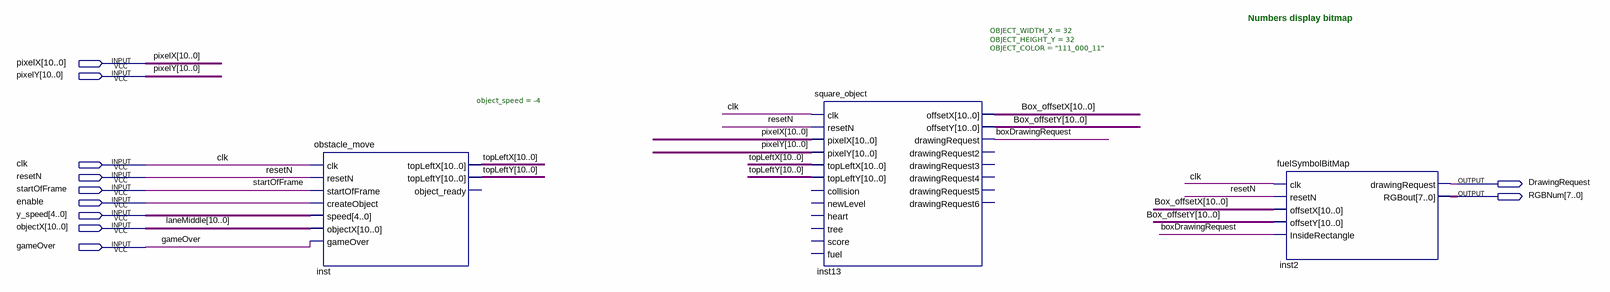
[diagram p0: schematic sheet]
// Quartus schematic fuel_symbol_block.bdf as structural Verilog: 3 symbols, 11 pins
module fuel_symbol_block (
  input  [10:0] pixelX,
  input  [10:0] pixelY,
  input  clk,
  input  resetN,
  input  startOfFrame,
  input  enable,
  input  [4:0] y_speed,
  input  [10:0] objectX,
  input  gameOver,
  output DrawingRequest,
  output [7:0] RGBNum
);

  wire boxDrawingRequest;
  wire [10:0] Box_offsetX, Box_offsetY, topLeftX, topLeftY;

  obstacle_move #(.object_speed(-4)) inst (
    .clk(clk), .resetN(resetN), .startOfFrame(startOfFrame), .createObject(enable), .speed(y_speed),
    .objectX(objectX), .gameOver(gameOver), .topLeftX(topLeftX), .topLeftY(topLeftY));  // open: object_ready
  square_object #(.OBJECT_WIDTH_X(32), .OBJECT_HEIGHT_Y(32), .OBJECT_COLOR("111_000_11")) inst13 (
    .clk(clk), .resetN(resetN), .pixelX(pixelX), .pixelY(pixelY), .topLeftX(topLeftX), .topLeftY(topLeftY),
    .offsetX(Box_offsetX), .offsetY(Box_offsetY), .drawingRequest(boxDrawingRequest));  // open: collision, newLevel, heart, tree, score, fuel, drawingRequest2, drawingRequest3, drawingRequest4, drawingRequest5, drawingRequest6
  fuelSymbolBitMap inst2 (
    .clk(clk), .resetN(resetN), .offsetX(Box_offsetX), .offsetY(Box_offsetY),
    .InsideRectangle(boxDrawingRequest), .drawingRequest(DrawingRequest), .RGBout(RGBNum));

  // Other names for the same wires on the sheet: laneMiddle[10:0] = objectX

  // Notes on the sheet:
  //   Numbers display bitmap
endmodule
